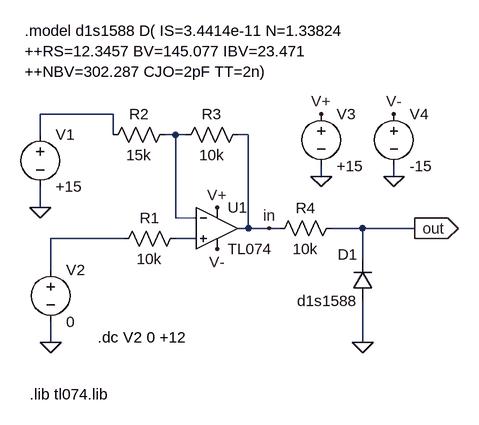
[diagram p0: schematic fig18.asc]
fig18.asc, the LTspice schematic file:
Version 4
SHEET 1 880 680
WIRE 48 -32 -64 -32
WIRE -64 0 -64 -32
WIRE 48 0 48 -32
WIRE 144 0 128 0
WIRE 160 0 144 0
WIRE 256 0 240 0
WIRE 368 64 368 48
WIRE 480 64 480 48
WIRE -64 112 -64 80
WIRE 144 128 144 0
WIRE 176 128 144 128
WIRE 256 144 256 0
WIRE 256 144 240 144
WIRE 288 144 256 144
WIRE 304 144 288 144
WIRE 432 144 384 144
WIRE 512 144 432 144
WIRE 64 160 -48 160
WIRE 176 160 144 160
WIRE 432 192 432 144
WIRE -48 208 -48 160
WIRE -48 320 -48 288
WIRE 432 320 432 256
FLAG -64 112 0
FLAG -48 320 0
FLAG 432 320 0
FLAG 512 144 out
IOPIN 512 144 Out
FLAG 368 64 0
FLAG 480 64 0
FLAG 368 -32 V+
FLAG 480 -32 V-
FLAG 208 112 V+
FLAG 208 176 V-
FLAG 288 144 in
SYMBOL Opamps\\opamp2 208 80 R0
SYMATTR InstName U1
SYMATTR Value TL074
SYMBOL res 48 176 R270
WINDOW 0 32 56 VTop 0
WINDOW 3 0 56 VBottom 0
SYMATTR InstName R1
SYMATTR Value 10k
SYMBOL res 32 16 R270
WINDOW 0 32 56 VTop 0
WINDOW 3 0 56 VBottom 0
SYMATTR InstName R2
SYMATTR Value 15k
SYMBOL res 144 16 R270
WINDOW 0 32 56 VTop 0
WINDOW 3 0 56 VBottom 0
SYMATTR InstName R3
SYMATTR Value 10k
SYMBOL res 288 160 R270
WINDOW 0 32 56 VTop 0
WINDOW 3 0 56 VBottom 0
SYMATTR InstName R4
SYMATTR Value 10k
SYMBOL voltage -64 -16 R0
WINDOW 123 0 0 Left 0
WINDOW 39 0 0 Left 0
SYMATTR InstName V1
SYMATTR Value +15
SYMBOL voltage -48 192 R0
WINDOW 123 0 0 Left 0
WINDOW 39 0 0 Left 0
SYMATTR InstName V2
SYMATTR Value 0
SYMBOL diode 448 256 R180
WINDOW 0 24 72 Left 0
WINDOW 3 24 0 Left 0
SYMATTR InstName D1
SYMATTR Value d1s1588
SYMBOL voltage 368 -48 R0
SYMATTR InstName V3
SYMATTR Value +15
SYMBOL voltage 480 -48 R0
SYMATTR InstName V4
SYMATTR Value -15
TEXT 24 312 Left 0 !.dc V2 0 +12
TEXT -80 400 Left 0 !.lib tl074.lib
TEXT -88 -160 Left 0 !.model d1s1588 D( IS=3.4414e-11 N=1.33824 \n++RS=12.3457 BV=145.077 IBV=23.471 \n++NBV=302.287 CJO=2pF TT=2n)

The netlist it stands for:
* fig18.asc
XU1 N004 N002 V+ V- in TL074  ; pins In+ In- V+ V- OUT
R1 N003 N004 10k
R2 N001 N002 15k
R3 N002 in 10k
R4 in out 10k
V1 N001 0 +15
V2 N003 0 0
D1 0 out d1s1588
V3 V+ 0 +15
V4 V- 0 -15
.model D D
.lib standard.dio
.dc V2 0 +12
.lib tl074.lib
.model d1s1588 D( IS=3.4414e-11 N=1.33824
++RS=12.3457 BV=145.077 IBV=23.471
++NBV=302.287 CJO=2pF TT=2n)
.backanno
.end